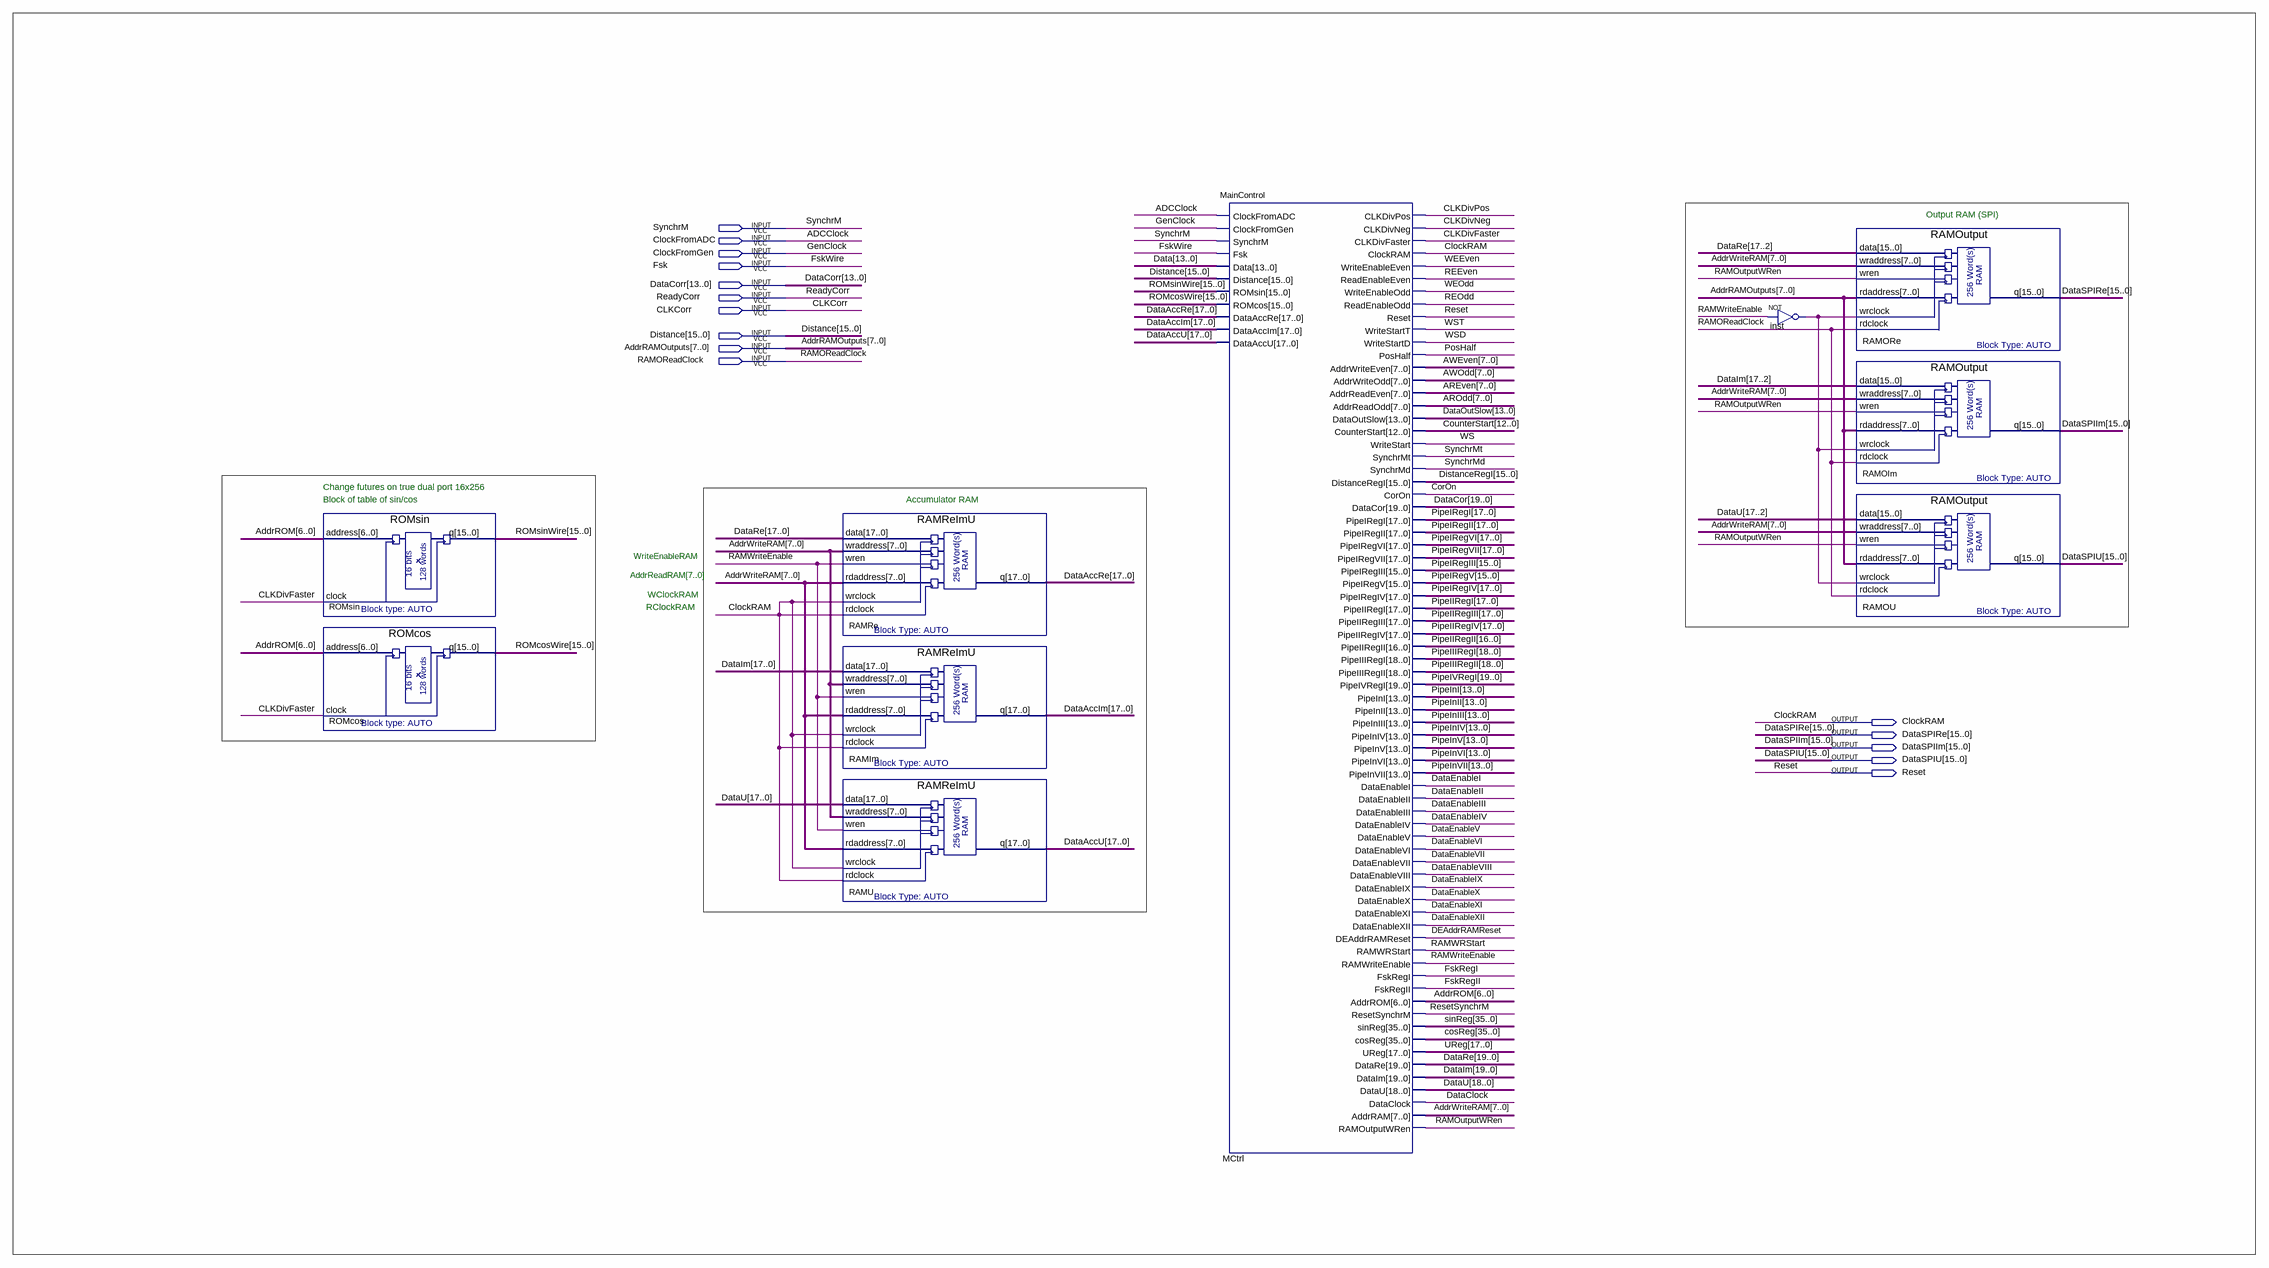
[diagram p0: schematic sheet]
// Quartus schematic MainCompile.bdf as structural Verilog: 10 symbols, 15 pins
module MainCompile (
  input  SynchrM,
  input  ClockFromADC,
  input  ClockFromGen,
  input  Fsk,
  input  [13:0] DataCorr,
  input  ReadyCorr,
  input  CLKCorr,
  input  [15:0] Distance,
  input  [7:0] AddrRAMOutputs,
  input  RAMOReadClock,
  output ClockRAM,
  output [15:0] DataSPIRe,
  output [15:0] DataSPIIm,
  output [15:0] DataSPIU,
  output Reset
);

  wire CLKDivFaster, CLKDivNeg, CLKDivPos, CorOn, DataClock, DataEnableI, DataEnableII, DataEnableIII,
       DataEnableIV, DataEnableIX, DataEnableV, DataEnableVI, DataEnableVII, DataEnableVIII, DataEnableX,
       DataEnableXI, DataEnableXII, DEAddrRAMReset, FskRegI, FskRegII, inst_out, PosHalf, RAMOutputWRen,
       RAMWriteEnable, RAMWRStart, REEven, REOdd, ResetSynchrM, SynchrMd, SynchrMt, WEEven, WEOdd, WS, WSD,
       WST;
  wire [6:0] AddrROM;
  wire [7:0] AddrWriteRAM, AREven, AROdd, AWEven, AWOdd;
  wire [12:0] CounterStart;
  wire [13:0] Data, DataOutSlow, PipeInI, PipeInII, PipeInIII, PipeInIV, PipeInV, PipeInVI, PipeInVII;
  wire [15:0] DistanceRegI, PipeIRegIII, PipeIRegV, ROMcosWire, ROMsinWire;
  wire [16:0] PipeIIRegII;
  wire [17:0] DataAccIm, DataAccRe, DataAccU, PipeIIRegI, PipeIIRegIII, PipeIIRegIV, PipeIRegI, PipeIRegII,
       PipeIRegIV, PipeIRegVI, PipeIRegVII, UReg;
  wire [18:0] DataU, PipeIIIRegI, PipeIIIRegII;
  wire [19:0] DataCor, DataIm, DataRe, PipeIVRegI;
  wire [35:0] cosReg, sinReg;

  ROMsin ROMsin (.address(AddrROM), .clock(CLKDivFaster), .q(ROMsinWire));
  ROMcos ROMcos (.address(AddrROM), .clock(CLKDivFaster), .q(ROMcosWire));
  RAMReImU RAMRe (
    .data(DataRe[17:0]), .wraddress(AddrWriteRAM), .wren(RAMWriteEnable), .rdaddress(AddrWriteRAM),
    .wrclock(ClockRAM), .rdclock(ClockRAM), .q(DataAccRe));
  RAMReImU RAMIm (
    .data(DataIm[17:0]), .wraddress(AddrWriteRAM), .wren(RAMWriteEnable), .rdaddress(AddrWriteRAM),
    .wrclock(ClockRAM), .rdclock(ClockRAM), .q(DataAccIm));
  RAMReImU RAMU (
    .data(DataU[17:0]), .wraddress(AddrWriteRAM), .wren(RAMWriteEnable), .rdaddress(AddrWriteRAM),
    .wrclock(ClockRAM), .rdclock(ClockRAM), .q(DataAccU));
  MainControl MCtrl (
    .ClockFromADC(ClockFromADC), .ClockFromGen(ClockFromGen), .SynchrM(SynchrM), .Fsk(Fsk), .Data(Data),
    .Distance(Distance), .ROMsin(ROMsinWire), .ROMcos(ROMcosWire), .DataAccRe(DataAccRe),
    .DataAccIm(DataAccIm), .DataAccU(DataAccU), .CLKDivPos(CLKDivPos), .CLKDivNeg(CLKDivNeg),
    .CLKDivFaster(CLKDivFaster), .ClockRAM(ClockRAM), .WriteEnableEven(WEEven), .ReadEnableEven(REEven),
    .WriteEnableOdd(WEOdd), .ReadEnableOdd(REOdd), .Reset(Reset), .WriteStartT(WST), .WriteStartD(WSD),
    .PosHalf(PosHalf), .AddrWriteEven(AWEven), .AddrWriteOdd(AWOdd), .AddrReadEven(AREven),
    .AddrReadOdd(AROdd), .DataOutSlow(DataOutSlow), .CounterStart(CounterStart), .WriteStart(WS),
    .SynchrMt(SynchrMt), .SynchrMd(SynchrMd), .DistanceRegI(DistanceRegI), .CorOn(CorOn), .DataCor(DataCor),
    .PipeIRegI(PipeIRegI), .PipeIRegII(PipeIRegII), .PipeIRegVI(PipeIRegVI), .PipeIRegVII(PipeIRegVII),
    .PipeIRegIII(PipeIRegIII), .PipeIRegV(PipeIRegV), .PipeIRegIV(PipeIRegIV), .PipeIIRegI(PipeIIRegI),
    .PipeIIRegIII(PipeIIRegIII), .PipeIIRegIV(PipeIIRegIV), .PipeIIRegII(PipeIIRegII),
    .PipeIIIRegI(PipeIIIRegI), .PipeIIIRegII(PipeIIIRegII), .PipeIVRegI(PipeIVRegI), .PipeInI(PipeInI),
    .PipeInII(PipeInII), .PipeInIII(PipeInIII), .PipeInIV(PipeInIV), .PipeInV(PipeInV), .PipeInVI(PipeInVI),
    .PipeInVII(PipeInVII), .DataEnableI(DataEnableI), .DataEnableII(DataEnableII),
    .DataEnableIII(DataEnableIII), .DataEnableIV(DataEnableIV), .DataEnableV(DataEnableV),
    .DataEnableVI(DataEnableVI), .DataEnableVII(DataEnableVII), .DataEnableVIII(DataEnableVIII),
    .DataEnableIX(DataEnableIX), .DataEnableX(DataEnableX), .DataEnableXI(DataEnableXI),
    .DataEnableXII(DataEnableXII), .DEAddrRAMReset(DEAddrRAMReset), .RAMWRStart(RAMWRStart),
    .RAMWriteEnable(RAMWriteEnable), .FskRegI(FskRegI), .FskRegII(FskRegII), .AddrROM(AddrROM),
    .ResetSynchrM(ResetSynchrM), .sinReg(sinReg), .cosReg(cosReg), .UReg(UReg), .DataRe(DataRe),
    .DataIm(DataIm), .DataU(DataU), .DataClock(DataClock), .AddrRAM(AddrWriteRAM),
    .RAMOutputWRen(RAMOutputWRen));
  not inst (inst_out, RAMWriteEnable);
  RAMOutput RAMORe (
    .data(DataRe[17:2]), .wraddress(AddrWriteRAM), .wren(RAMOutputWRen), .rdaddress(AddrRAMOutputs),
    .wrclock(inst_out), .rdclock(RAMOReadClock), .q(DataSPIRe));
  RAMOutput RAMOIm (
    .data(DataIm[17:2]), .wraddress(AddrWriteRAM), .wren(RAMOutputWRen), .rdaddress(AddrRAMOutputs),
    .wrclock(inst_out), .rdclock(RAMOReadClock), .q(DataSPIIm));
  RAMOutput RAMOU (
    .data(DataU[17:2]), .wraddress(AddrWriteRAM), .wren(RAMOutputWRen), .rdaddress(AddrRAMOutputs),
    .wrclock(inst_out), .rdclock(RAMOReadClock), .q(DataSPIU));

  // Other names for the same wires on the sheet: ADCClock = ClockFromADC; FskWire = Fsk; GenClock = ClockFromGen

  // Notes on the sheet:
  //   Output RAM (SPI)
  //   Change futures on true dual port 16x256
  //   Block of table of sin/cos
  //   Accumulator RAM
  //   WriteEnableRAM
  //   AddrReadRAM[7..0]
  //   WClockRAM
  //   RClockRAM
endmodule
